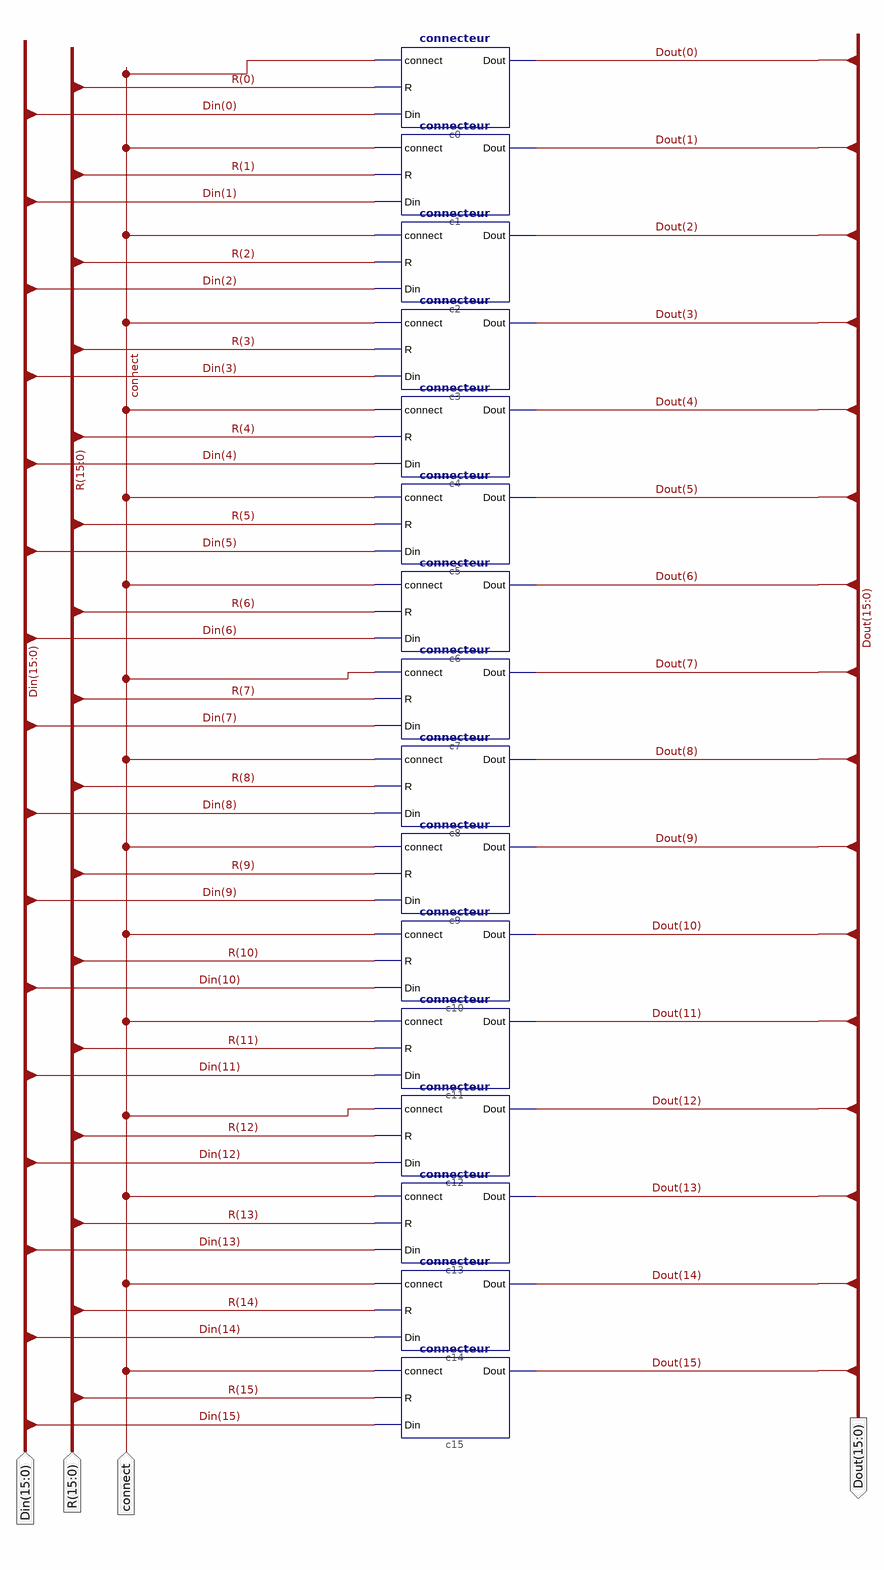
[diagram p0: schematic sheet 1]
// Xilinx ISE schematic connecteur16.sch (spartan3e) as structural Verilog: 16 symbols, 4 ports
module connecteur16 (
  input  [15:0] Din,
  input  [15:0] R,
  input  connect,
  output [15:0] Dout
);

  connecteur c0 (.connect(connect), .R(R[0]), .Din(Din[0]), .Dout(Dout[0]));
  connecteur c1 (.connect(connect), .R(R[1]), .Din(Din[1]), .Dout(Dout[1]));
  connecteur c2 (.connect(connect), .R(R[2]), .Din(Din[2]), .Dout(Dout[2]));
  connecteur c12 (.connect(connect), .R(R[12]), .Din(Din[12]), .Dout(Dout[12]));
  connecteur c11 (.connect(connect), .R(R[11]), .Din(Din[11]), .Dout(Dout[11]));
  connecteur c10 (.connect(connect), .R(R[10]), .Din(Din[10]), .Dout(Dout[10]));
  connecteur c9 (.connect(connect), .R(R[9]), .Din(Din[9]), .Dout(Dout[9]));
  connecteur c8 (.connect(connect), .R(R[8]), .Din(Din[8]), .Dout(Dout[8]));
  connecteur c7 (.connect(connect), .R(R[7]), .Din(Din[7]), .Dout(Dout[7]));
  connecteur c6 (.connect(connect), .R(R[6]), .Din(Din[6]), .Dout(Dout[6]));
  connecteur c5 (.connect(connect), .R(R[5]), .Din(Din[5]), .Dout(Dout[5]));
  connecteur c4 (.connect(connect), .R(R[4]), .Din(Din[4]), .Dout(Dout[4]));
  connecteur c3 (.connect(connect), .R(R[3]), .Din(Din[3]), .Dout(Dout[3]));
  connecteur c13 (.connect(connect), .R(R[13]), .Din(Din[13]), .Dout(Dout[13]));
  connecteur c14 (.connect(connect), .R(R[14]), .Din(Din[14]), .Dout(Dout[14]));
  connecteur c15 (.connect(connect), .R(R[15]), .Din(Din[15]), .Dout(Dout[15]));
endmodule
